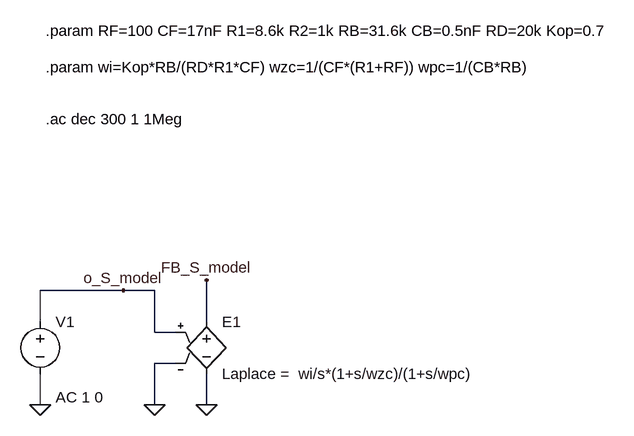
[diagram p0: schematic GFB_o.asc]
GFB_o.asc, the LTspice schematic file:
Version 4
SHEET 1 1004 680
WIRE 128 144 0 144
WIRE 176 144 128 144
WIRE 0 192 0 144
WIRE 256 192 256 128
WIRE 176 208 176 144
WIRE 208 208 176 208
WIRE 208 256 176 256
WIRE 0 320 0 272
WIRE 176 320 176 256
WIRE 256 320 256 272
FLAG 256 320 0
FLAG 0 320 0
FLAG 256 128 FB_S_model
FLAG 176 320 0
FLAG 128 144 o_S_model
SYMBOL e 256 176 R0
SYMATTR InstName E1
SYMATTR Value Laplace =  wi/s*(1+s/wzc)/(1+s/wpc)
SYMBOL voltage 0 176 R0
WINDOW 123 24 132 Left 0
WINDOW 39 0 0 Left 0
SYMATTR Value2 AC 1 0
SYMATTR InstName V1
SYMATTR Value ""
TEXT 8 -256 Left 0 !.param RF=100 CF=17nF R1=8.6k R2=1k RB=31.6k CB=0.5nF RD=20k Kop=0.7
TEXT 8 -200 Left 0 !.param wi=Kop*RB/(RD*R1*CF) wzc=1/(CF*(R1+RF)) wpc=1/(CB*RB)
TEXT 8 -120 Left 0 !.ac dec 300 1 1Meg

The netlist it stands for:
* GFB_o.asc
E1 FB_S_model 0 o_S_model 0 Laplace =  wi/s*(1+s/wzc)/(1+s/wpc)
V1 o_S_model 0 AC 1 0
.param RF=100 CF=17nF R1=8.6k R2=1k RB=31.6k CB=0.5nF RD=20k Kop=0.7
.param wi=Kop*RB/(RD*R1*CF) wzc=1/(CF*(R1+RF)) wpc=1/(CB*RB)
.ac dec 300 1 1Meg
.backanno
.end